# Altium schematic sheet 02-Power_Supply.SchDoc: Power Supply
size A4; Engineer: Juan M Garin; Organization: ESO; Address1: Juan M Garin; DocumentNumber: 2; Revision: 1.0; SheetNumber: 2; SheetTotal: 6
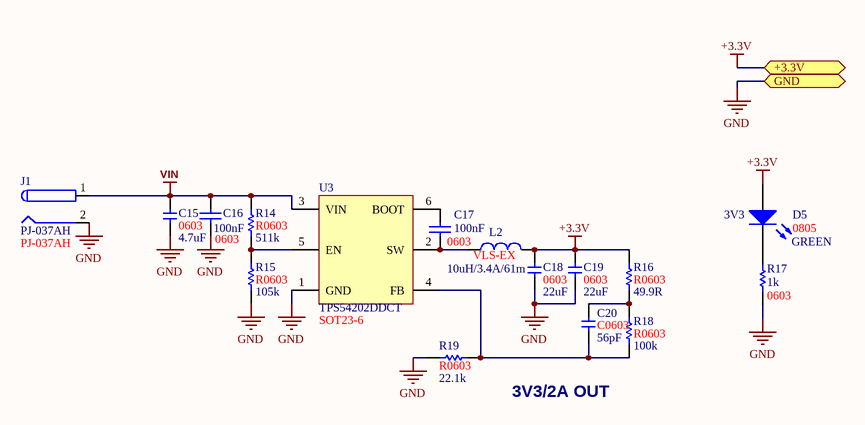
[diagram p0: 02-Power_Supply.SchDoc]

## Parts
C15  PackageReference: 0603  [C0603]  (hidden comment: 4.7uF)
C16  100nF  PackageReference: 0603  [C0603]
C17  100nF  PackageReference: 0603  [C0603]
C18  PackageReference: 0603  [C0603]  (hidden comment: 22uF)
C19  PackageReference: 0603  [C0603]  (hidden comment: 22uF)
C20  56pF  [C0603]
D5  3V3  value GREEN  PackageReference: 0805  [LED0805]
J1  PJ-037AH  [CON_PJ-037A]
L2  PackageReference: VLS-EX  [IND6045]  (hidden comment: 10uH/3.4A/61m)
R14  511k  [R0603]
R15  105k  [R0603]
R16  49.9R  [R0603]
R17  1k  PackageReference: 0603  [R0603]
R18  100k  [R0603]
R19  22.1k  [R0603]
U3  TPS54202DDCT  [SOT23-6]

## Ports
+3.3V, GND

## Nets
+3.3V: C18.2 C19.2 D5.1(A) L2.2 R16.1 ; port +3.3V
GND: C15.1 C16.1 C18.1 C19.1 J1.2 R15.2 R17.1 R19.1 U3.1(GND) ; port GND
VIN: C15.2 C16.2 J1.1 R14.1 U3.3(VIN)
NetC17_1: C17.1 L2.1 U3.2(SW)
NetC17_2: C17.2 U3.6(BOOT)
NetC20_1: C20.1 R18.2 R19.2 U3.4(FB)
NetC20_2: C20.2 R16.2 R18.1
NetD5_2: D5.2(K) R17.2
NetR14_2: R14.2 R15.1 U3.5(EN)

## Notes on the sheet
- 3V3/2A OUT
- Title
- Size:
- Date:
- A4
- Number:
- Time:
- Revision:
- Sheet
- of
- File:

## Library data of the parts
C15 = Cap_0603: Capacitor; Manufacturer Part Number: C1608X5R1C475M080AC; Value: 4.7uF
C16 C17 = Cap Semi: Capacitor (Semiconductor SIM Model); Manufacturer Part Number: CL10F104ZO8NNNC; Value: 100nF
C18 C19 = Cap_0603: Capacitor; Manufacturer Part Number: CL10A226MQ8NRNC; Value: 22uF
C20 = Cap_0402: Capacitor; Manufacturer Part Number: CL10C560JB8NNNC; PackageReference: C0603; Value: 56pF
D5 = LED_SMD: GREEN; Manufacturer Part Number: LTST-S220GKT
J1 = PJ-037AH: CONN PWR JACK 2X5.5MM SOLDER; Manufacturer Part Number: PJ-037AH; PackageReference: PJ-037AH
L2 = Inductor_0603: Inductor; Manufacturer Part Number: VLS6045EX-100M; Value: 10uH/3.4A/61m
R14 = Res_0402: Resistor; Manufacturer Part Number: RMCF0603FT511K; PackageReference: R0603; Value: 511k
R15 = Res_0402: Resistor; Manufacturer Part Number: RMCF0603FT105K; PackageReference: R0603; Value: 105k
R16 = Res_0402: Resistor; Manufacturer Part Number: RMCF0603FT49R9; PackageReference: R0603; Value: 49.9R
R17 = Res1: Resistor; Manufacturer Part Number: RMCF0603FG1K00; Value: 1k
R18 = Res_0402: Resistor; Manufacturer Part Number: CR0603-JW-104ELF; PackageReference: R0603; Value: 100k
R19 = Res_0402: Resistor; Manufacturer Part Number: RNCP0603FTD22K1; PackageReference: R0603; Value: 22.1k
U3 = TPS54202DDCT: IC REG BUCK ADJ 2A SYNC SOT23-6; Manufacturer Part Number: TPS54202DDCT; PackageReference: SOT23-6